# EAGLE schematic GarageMote (EAGLE 6.5.0)
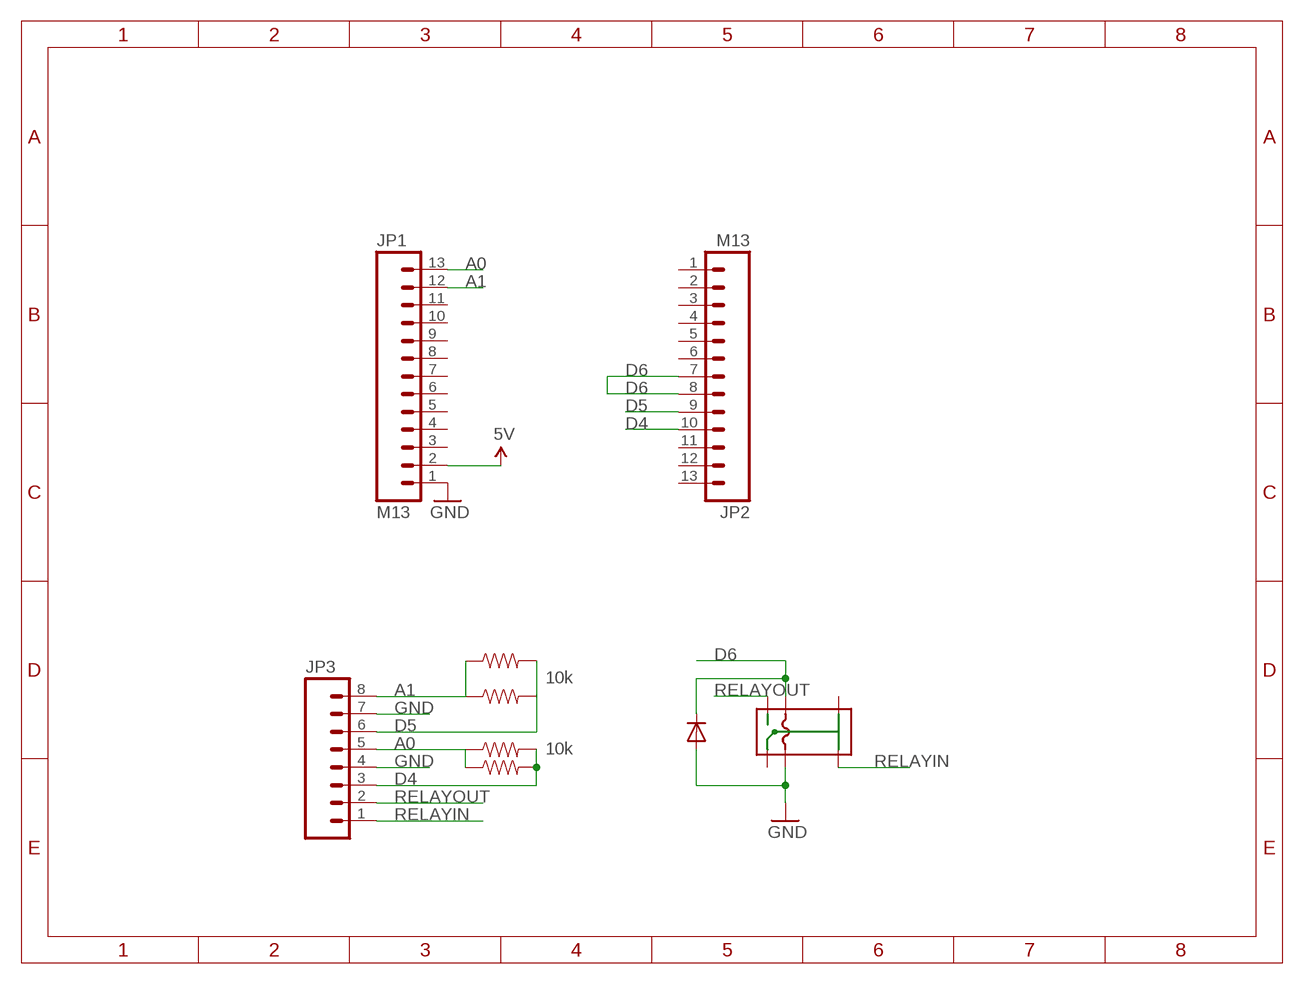
[diagram p0: schematic, sheet 1]

## Parts
1N4001  DIODEUPRIGHT  [DIODE_UPRIGHT]
JP1  M13  [1X13]
JP2  M13  [1X13]
JP3  M081X08  [1X08]
JRC-2F  JRC-23F  [JRC-23F]
R1  10k  RESISTOR0603-RES  [0603-RES]
R2  10k  RESISTOR0603-RES  [0603-RES]
R3  RESISTOR1/4W  [AXIAL-1/4W]
R4  RESISTOR1/4W  [AXIAL-1/4W]

## Nets
5V: JP1.2
A0: JP1.13 JP3.5 R1.1 R3.P$1
A1: JP1.12 JP3.8 R2.1 R4.P$1
D4: JP2.10 JP3.3 R1.2 R3.P$2
D5: JP2.9 JP3.6 R2.2 R4.P$2
D6: 1N4001.CATHODE_MINUS JP2.7 JP2.8 JRC-2F.COIL1
GND: 1N4001.ANODE_PLUS JP1.1 JP3.4 JP3.7 JRC-2F.COIL2
RELAYIN: JP3.1 JRC-2F.COM2
RELAYOUT: JP3.2 JRC-2F.SW1
Unconnected: JP1.3 JP1.4 JP1.5 JP1.6 JP1.7 JP1.8 JP1.9 JP1.10 JP1.11 JP2.1 JP2.2 JP2.3 JP2.4 JP2.5 JP2.6 JP2.11 JP2.12 JP2.13 JRC-2F.COM1 JRC-2F.SW2

## Library data of the parts
1N4001 = LowPowerLab:DIODE
JP1 JP2 = SparkFun-Connectors:M13: 13-pin single row .1" header
JP3 = SparkFun-Connectors:M08: Header 8 Standard 8-pin 0.1" header. Use with straight break away headers (SKU : PRT-00116), right angle break away headers (PRT-00553), swiss pins (PRT-00743), machine pins (PRT-00117), and female headers (PRT-00115).
JRC-2F = LowPowerLab:JRC-23F
R1-R4 = LowPowerLab:RESISTOR: Resistor Basic schematic elements and footprints for 0603, 1206, and PTH resistors.